# Altium project B1001_01.PrjPCB
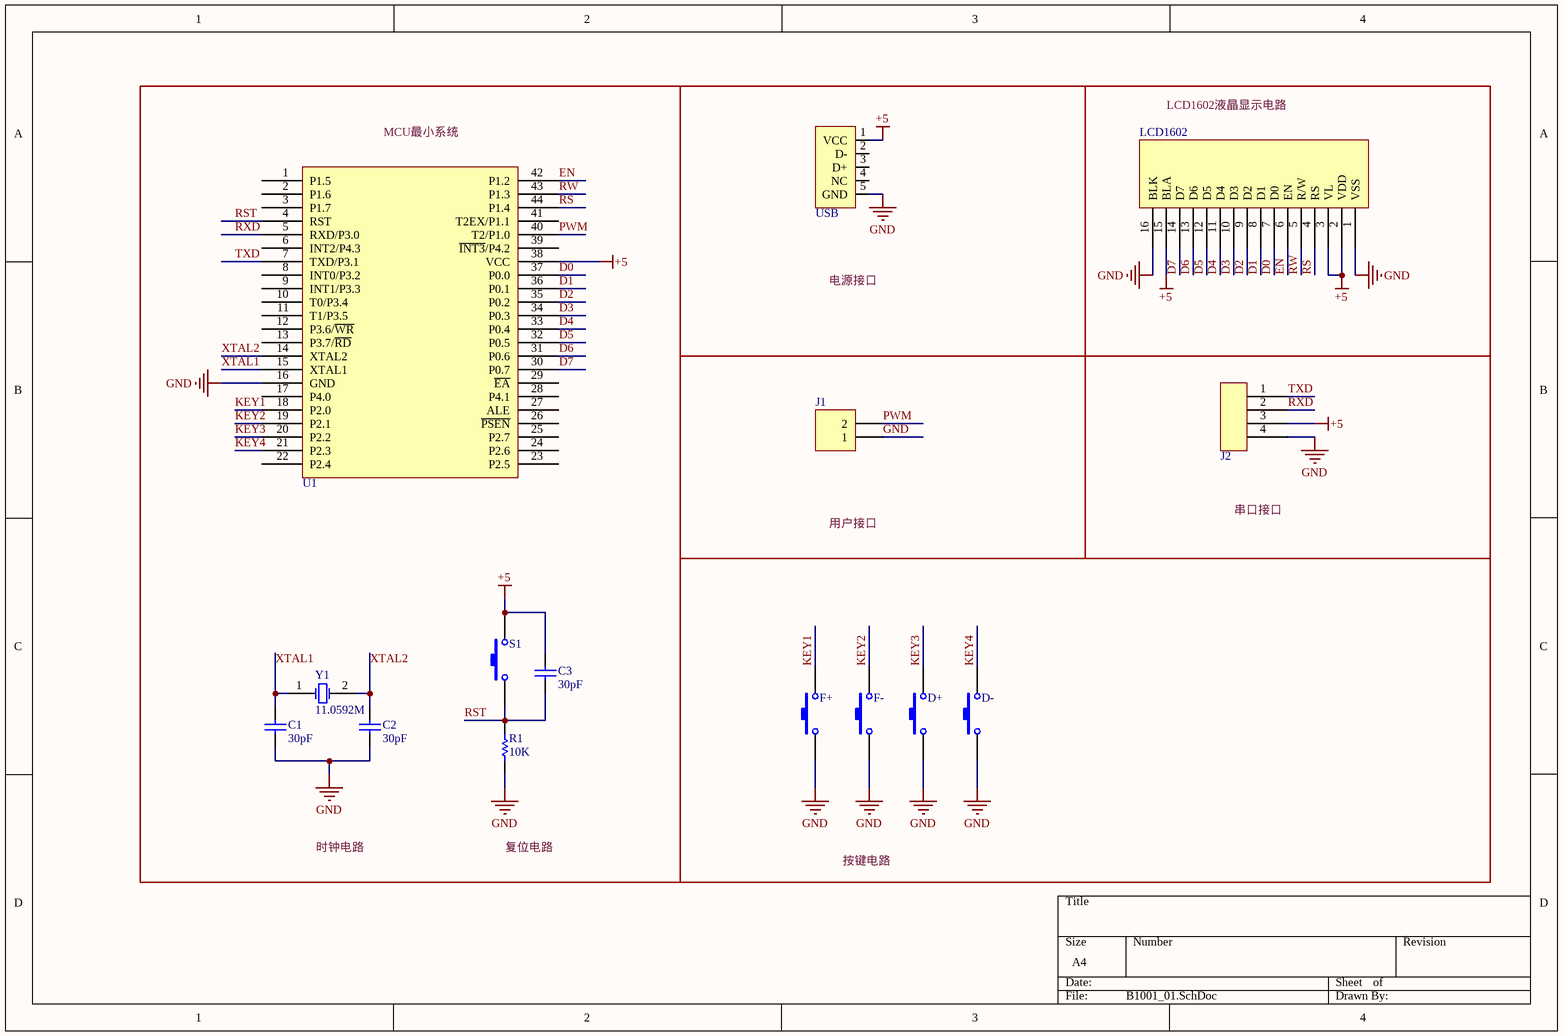
[diagram p0: B1001_01.SchDoc]
1 sheet, 15 parts. Net scope: global (net labels, ports and power ports of the same name join across sheets).
Board file: B1001_01.PcbDoc

## Sheet B1001_01.SchDoc
size A4

### Parts
C1  value 30pF  [0603P]  (hidden comment: Cap)
C2  value 30pF  [0603P]  (hidden comment: Cap)
C3  value 30pF  [0603P]  (hidden comment: Cap)
D+  SW-PB  [SMD4]  (value not drawn)
D-  SW-PB  [SMD4]  (value not drawn)
F+  SW-PB  [SMD4]  (value not drawn)
F-  SW-PB  [SMD4]  (value not drawn)
J1  Header 2  [HDR1X2]  (value not drawn)
J2  CON4  [HDR1X4]  (value not drawn)
LCD1602  LCD1602  [HDR1X16]  (value not drawn)
R1  value 10K  [0603P]  (hidden comment: Res1)
S1  SW-PB  [SMD4]  (value not drawn)
U1  STC89C52  [LQFP-44]  (value not drawn)
USB  USB  [USB/SM0.8-6H5]  (value not drawn)
Y1  11.0592M  [SMD5032]

### Nets
+5: C3.2 J2.3 LCD1602.2(VDD) LCD1602.3(VL) LCD1602.15(BLA) S1.2 U1.38(VCC) USB.1(VCC)
GND: C1.1 C2.1 D+.1 D-.1 F+.1 F-.1 J1.1 J2.4 LCD1602.1(VSS) LCD1602.16(BLK) R1.1 U1.16(GND) USB.5(GND)
D0: LCD1602.7(D0) U1.37(P0.0)
D1: LCD1602.8(D1) U1.36(P0.1)
D2: LCD1602.9(D2) U1.35(P0.2)
D3: LCD1602.10(D3) U1.34(P0.3)
D4: LCD1602.11(D4) U1.33(P0.4)
D5: LCD1602.12(D5) U1.32(P0.5)
D6: LCD1602.13(D6) U1.31(P0.6)
D7: LCD1602.14(D7) U1.30(P0.7)
EN: LCD1602.6(EN) U1.42(P1.2)
KEY1: F+.2 U1.18(P2.0)
KEY2: F-.2 U1.19(P2.1)
KEY3: D+.2 U1.20(P2.2)
KEY4: D-.2 U1.21(P2.3)
PWM: J1.2 U1.40(T2/P1.0)
RS: LCD1602.4(RS) U1.44(P1.4)
RST: C3.1 R1.2 S1.1 U1.4(RST)
RW: LCD1602.5(R/W) U1.43(P1.3)
RXD: J2.2 U1.5(RXD/P3.0)
TXD: J2.1 U1.7(TXD/P3.1)
XTAL1: C1.2 U1.15(XTAL1) Y1.1(OSC1)
XTAL2: C2.2 U1.14(XTAL2) Y1.2(OSC2)

Not connected (* = marked no-connect by the designer): U1 1(P1.5) 2(P1.6) 3(P1.7) 6(INT2/P4.3) 8(INT0/P3.2) 9(INT1/P3.3) 10(T0/P3.4) 11(T1/P3.5) 12(P3.6/~{WR}) 13(P3.7/~{RD}) 17(P4.0) 22(P2.4) 23(P2.5) 24(P2.6) 25(P2.7) 26(~{PSEN}) 27(ALE) 28(P4.1) 29(~{EA}) 39(~{INT3}/P4.2) 41(T2EX/P1.1); USB 2(D-) 3(D+) 4(NC)

### Notes on the sheet
- LCD1602液晶显示电路
- (near U1) MCU最小系统
- 电源接口
- 串口接口
- 用户接口
- 时钟电路
- 复位电路
- 按键电路

### Library data of the parts
C1-C3 = Cap: Capacitor; Published: 8-Jun-2000; LatestRevisionDate: 17-Jul-2002; LatestRevisionNote: Re-released for DXP Platform.; PackageReference: RAD-0.3; Publisher: Altium Limited; PackageDescription: Radial Cap, Thru-Hole; 2 Leads; 0.3 in Pin Spacing
D+ D- F+ F- S1 = SW-PB: Switch; Published: 24-Mar-1999; LatestRevisionDate: 17-Jul-2002; LatestRevisionNote: Re-released for DXP Platform.; PackageReference: SPST-2; Publisher: Altium Limited; PackageDescription: Switch; 2 Leads
J1 = Header 2: Header, 2-Pin; LatestRevisionDate: 17-Jul-2002; LatestRevisionNote: Re-released for DXP Platform.; Publisher: Altium Limited
R1 = Res1: Resistor; Published: 8-Jun-2000; LatestRevisionDate: 17-Jul-2002; LatestRevisionNote: Re-released for DXP Platform.; PackageReference: AXIAL-0.3; Publisher: Altium Limited; PackageDescription: Axial Device, Thru-Hole; 2 Leads; 0.3 in Pin Spacing
Y1 = XTAL: Crystal Oscillator; Published: 8-Jun-2000; LatestRevisionDate: 17-Jul-2002; LatestRevisionNote: Re-released for DXP Platform.; PackageReference: R38; Publisher: Altium Limited; PackageDescription: Crystal, Thru-Hole; 2 Leads; Body 3.1 x 8.2 mm (Dia.xH)